# EasyEDA schematic SCH_HC Business Card_2023-06-01.json
TITLE: Simple NFC Business Card; REV: 1.0; Date: 2023-05-29; Sheet: 1/1; Drawn By: Camdan Mead; Company: Camdan Mead
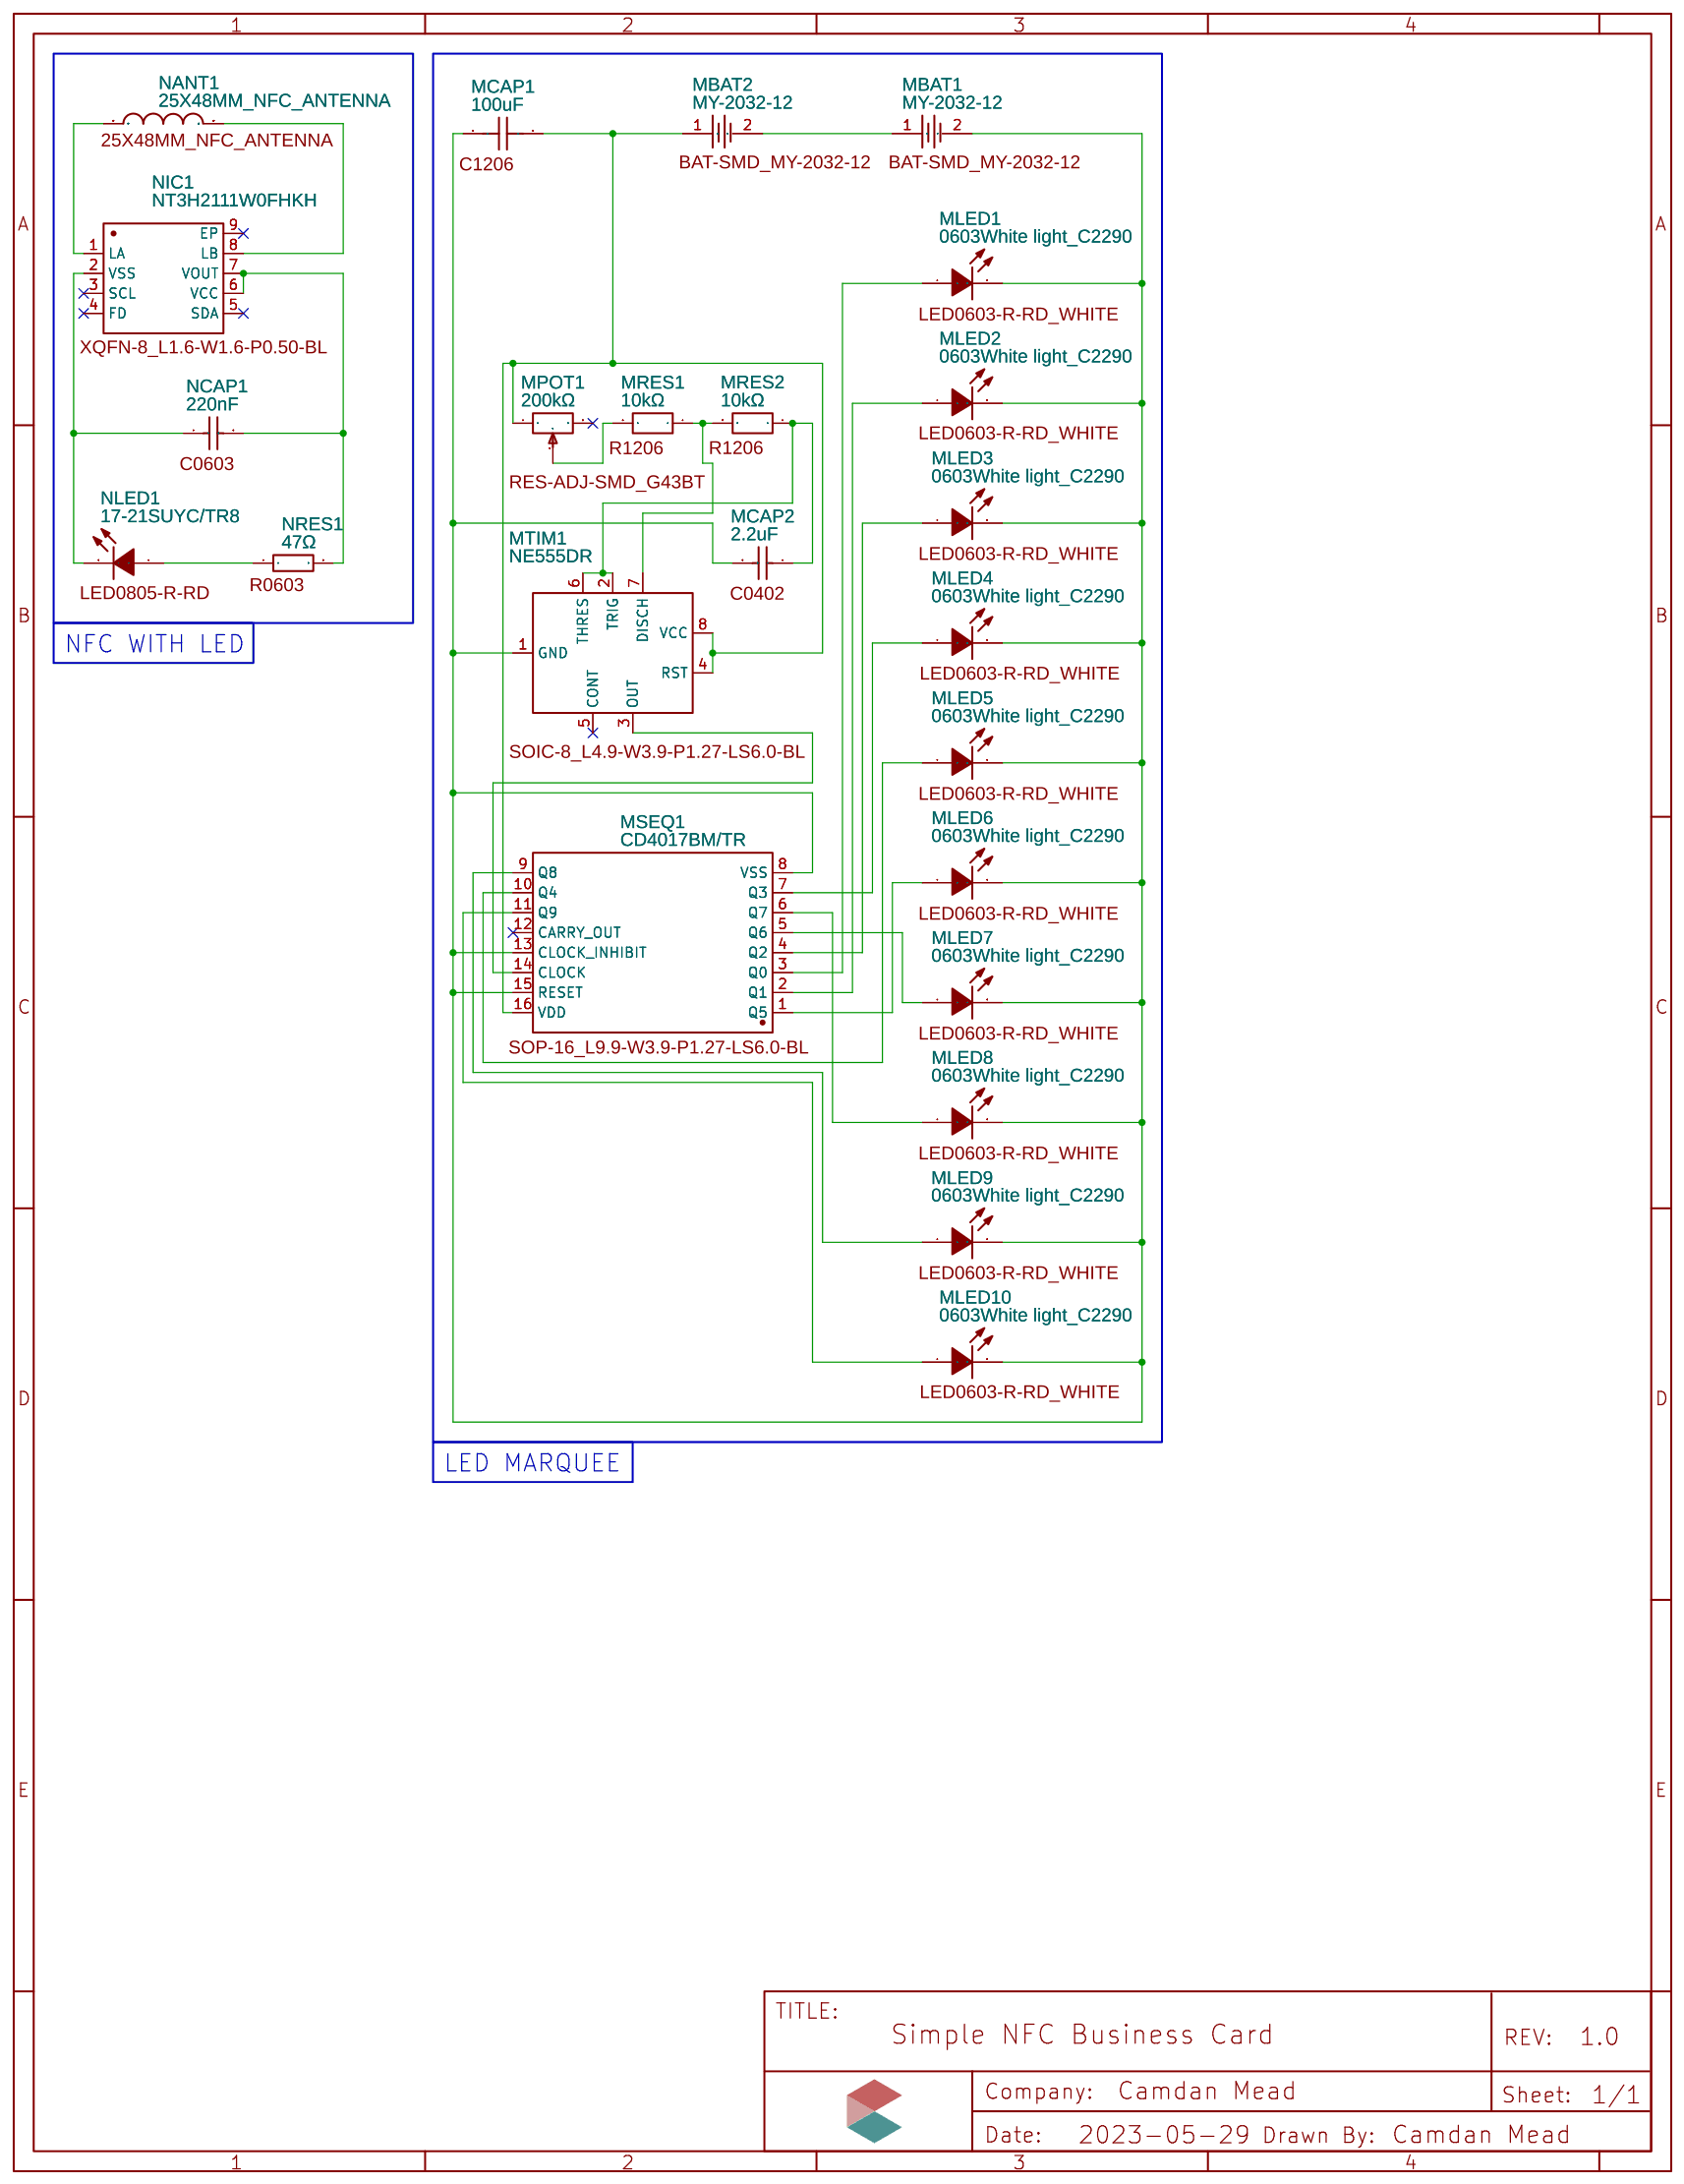
[diagram p0: schematic sheet]

## Parts
MBAT1  MY-2032-12  [BAT-SMD_MY-2032-12]
MBAT2  MY-2032-12  [BAT-SMD_MY-2032-12]
MCAP1  100uF  [C1206]
MCAP2  2.2uF  [C0402]
MLED1  0603White light_C2290  [LED0603-R-RD_WHITE]
MLED2  0603White light_C2290  [LED0603-R-RD_WHITE]
MLED3  0603White light_C2290  [LED0603-R-RD_WHITE]
MLED4  0603White light_C2290  [LED0603-R-RD_WHITE]
MLED5  0603White light_C2290  [LED0603-R-RD_WHITE]
MLED6  0603White light_C2290  [LED0603-R-RD_WHITE]
MLED7  0603White light_C2290  [LED0603-R-RD_WHITE]
MLED8  0603White light_C2290  [LED0603-R-RD_WHITE]
MLED9  0603White light_C2290  [LED0603-R-RD_WHITE]
MLED10  0603White light_C2290  [LED0603-R-RD_WHITE]
MPOT1  200kΩ  [RES-ADJ-SMD_G43BT]
MRES1  10kΩ  [R1206]
MRES2  10kΩ  [R1206]
MSEQ1  CD4017BM/TR  [SOP-16_L9.9-W3.9-P1.27-LS6.0-BL]
MTIM1  NE555DR  [SOIC-8_L4.9-W3.9-P1.27-LS6.0-BL]
NANT1  25X48MM_NFC_ANTENNA  [25X48MM_NFC_ANTENNA]
NCAP1  220nF  [C0603]
NIC1  NT3H2111W0FHKH  [XQFN-8_L1.6-W1.6-P0.50-BL]
NLED1  17-21SUYC/TR8  [LED0805-R-RD]
NRES1  47Ω  [R0603]

## Library data of the parts
MBAT1 MBAT2 = MY-2032-12: Supplier: LCSC; Supplier Part: C964833; Manufacturer: MYOUNG(美阳); Contributor: LCSC; JLCPCB Part Class: Extended Part; Package Display: Yes
MCAP1 = JMK316ABJ107ML-T: Supplier: LCSC; Supplier Part: C268006; Manufacturer: TAIYO YUDEN(太诱); Contributor: LCSC; JLCPCB Part Class: Extended Part; Package Display: Yes
MCAP2 = GRM155R60J225ME15D: Supplier: LCSC; Manufacturer: muRata(村田); Supplier Part: C76993; JLCPCB Part Class: Extended Part; Package Display: Yes
MLED1-MLED10 = 0603White light_C2290: Supplier: LCSC; Manufacturer: KENTO; Manufacturer Part: KT-0603白灯; Supplier Part: C2290; JLCPCB Part Class: Basic Part; Package Display: Yes
MPOT1 = G43BT-B204: Supplier: LCSC; Manufacturer: TOCOS; Resistance(Ohms): 200K; Contributor: LCSC; Supplier Part: C128150; Resistance (Ohms): 200K; JLCPCB Part Class: Extended Part; Package Display: Yes
MRES1 MRES2 = CR1206J10K0P05Z: Supplier: LCSC; Supplier Part: C881379; Manufacturer: EVER OHMS(天二科技); Contributor: LCSC; JLCPCB Part Class: Extended Part; Package Display: Yes
MSEQ1 = CD4017BM/TR: Supplier: LCSC; Supplier Part: C356694; Manufacturer: HGSEMI(华冠); Contributor: LCSC; JLCPCB Part Class: Extended Part; Package Display: Yes
MTIM1 = NE555DR: Supplier: LCSC; Manufacturer: TI(德州仪器); Supplier Part: C7593; JLCPCB Part Class: Basic Part; Frequency: 100kHz; Package Display: Yes
NANT1 = 25X48MM_NFC_ANTENNA: Contributor: david.knell; Package Display: Yes
NCAP1 = CL10B224KA8NNNC: Supplier: LCSC; Manufacturer: SAMSUNG(三星); Supplier Part: C21120; JLCPCB Part Class: Basic Part; Package Display: Yes
NIC1 = NT3H2111W0FHKH: Supplier: LCSC; Supplier Part: C710403; Manufacturer: NXP(恩智浦); JLCPCB Part Class: Extended Part; Contributor: LCSC; Package Display: Yes
NLED1 = 17-21SUYC/TR8: Supplier: LCSC; Manufacturer: KENTO; Manufacturer Part: KT-0805黄灯; Supplier Part: C2296; JLCPCB Part Class: Basic Part; Package Display: Yes
NRES1 = 0603WAF470JT5E: Supplier: LCSC; Manufacturer: UNI-ROYAL(厚声); Supplier Part: C23182; Resistance (Ohms): 47; JLCPCB Part Class: Basic Part; Package Display: Yes

## Nets
Net-(MBAT1-1): MBAT1.1 MBAT2.2
Net-(MBAT1-2): MBAT1.2 MCAP1.2 MCAP2.2 MLED1.2(K) MLED2.2(K) MLED3.2(K) MLED4.2(K) MLED5.2(K) MLED6.2(K) MLED7.2(K) MLED8.2(K) MLED9.2(K) MLED10.2(K) MSEQ1.8(VSS) MSEQ1.13(CLOCK INHIBIT) MSEQ1.15(RESET) MTIM1.1(GND)
Net-(MBAT2-1): MBAT2.1 MCAP1.1 MPOT1.1 MSEQ1.16(VDD) MTIM1.4(RST) MTIM1.8(VCC)
Net-(MCAP2-1): MCAP2.1 MRES2.1 MTIM1.2(TRIG) MTIM1.6(THRES)
Net-(MLED1-1): MLED1.1(A) MSEQ1.3(Q0)
Net-(MLED2-1): MLED2.1(A) MSEQ1.2(Q1)
Net-(MLED3-1): MLED3.1(A) MSEQ1.4(Q2)
Net-(MLED4-1): MLED4.1(A) MSEQ1.7(Q3)
Net-(MLED5-1): MLED5.1(A) MSEQ1.10(Q4)
Net-(MLED6-1): MLED6.1(A) MSEQ1.1(Q5)
Net-(MLED7-1): MLED7.1(A) MSEQ1.5(Q6)
Net-(MLED8-1): MLED8.1(A) MSEQ1.6(Q7)
Net-(MLED9-1): MLED9.1(A) MSEQ1.9(Q8)
Net-(MLED10-1): MLED10.1(A) MSEQ1.11(Q9)
Net-(MPOT1-2): MPOT1.2 MRES1.2
Net-(MRES1-1): MRES1.1 MRES2.2 MTIM1.7(DISCH)
Net-(MSEQ1-14): MSEQ1.14(CLOCK) MTIM1.3(OUT)
Net-(NANT1-P$1): NANT1.P$1 NIC1.1(LA)
Net-(NANT1-P$2): NANT1.P$2 NIC1.8(LB)
Net-(NCAP1-1): NCAP1.1 NIC1.2(VSS) NLED1.2(-)
Net-(NCAP1-2): NCAP1.2 NIC1.6(VCC) NIC1.7(VOUT) NRES1.2
Net-(NLED1-1): NLED1.1(+) NRES1.1

Not connected (* = marked no-connect by the designer): MPOT1 3*; MSEQ1 12(CARRY OUT)*; MTIM1 5(CONT)*; NIC1 3(SCL)* 4(FD)* 5(SDA)* 9(EP)*

## Notes on the sheet
- NFC WITH LED
- LED MARQUEE
